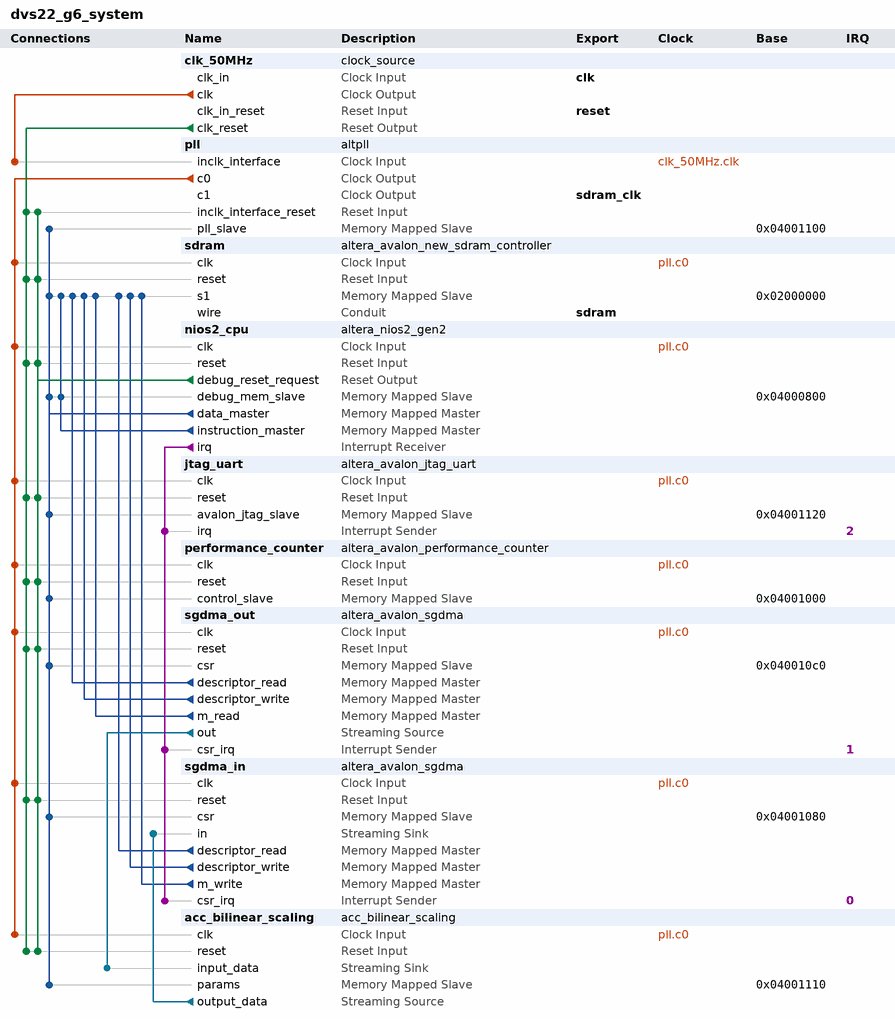
[diagram p0: system contents]
# Platform Designer (Qsys) system dvs22_g6_system, Cyclone IV E EP4CE22F17C6
# Parameters at their usual value, and those the tool derives, are not listed.
package require -exact qsys 20.1
create_system dvs22_g6_system
set_project_property DEVICE_FAMILY {Cyclone IV E}
set_project_property DEVICE EP4CE22F17C6

add_instance clk_50MHz clock_source 20.1
set_instance_parameter_value clk_50MHz clockFrequency 50000000

add_instance pll altpll 20.1
set_instance_parameter_value pll CLK0_DIVIDE_BY 1
set_instance_parameter_value pll CLK0_MULTIPLY_BY 1
set_instance_parameter_value pll CLK0_PHASE_SHIFT 3000
set_instance_parameter_value pll CLK1_DIVIDE_BY 1
set_instance_parameter_value pll CLK1_DUTY_CYCLE 50
set_instance_parameter_value pll CLK1_MULTIPLY_BY 1
set_instance_parameter_value pll CLK1_PHASE_SHIFT 0
set_instance_parameter_value pll INCLK0_INPUT_FREQUENCY 20000
set_instance_parameter_value pll PORT_ARESET PORT_UNUSED
set_instance_parameter_value pll PORT_LOCKED PORT_UNUSED
set_instance_parameter_value pll PORT_clk1 PORT_USED
set_instance_parameter_value pll PORT_clk2 PORT_UNUSED
set_instance_parameter_value pll PORT_clk3 PORT_UNUSED

add_instance sdram altera_avalon_new_sdram_controller 20.1
set_instance_parameter_value sdram TAC 5.5
set_instance_parameter_value sdram TRCD 20.0
set_instance_parameter_value sdram TRP 20.0
set_instance_parameter_value sdram casLatency 3
set_instance_parameter_value sdram columnWidth 9
set_instance_parameter_value sdram dataWidth 16
set_instance_parameter_value sdram generateSimulationModel false
set_instance_parameter_value sdram model single_Micron_MT48LC4M32B2_7_chip
set_instance_parameter_value sdram numberOfBanks 4
set_instance_parameter_value sdram numberOfChipSelects 1
set_instance_parameter_value sdram powerUpDelay 100.0
set_instance_parameter_value sdram refreshPeriod 15.625
set_instance_parameter_value sdram rowWidth 13

add_instance nios2_cpu altera_nios2_gen2 20.1
set_instance_parameter_value nios2_cpu dcache_size 2048
set_instance_parameter_value nios2_cpu exceptionSlave sdram.s1
set_instance_parameter_value nios2_cpu icache_size 4096
set_instance_parameter_value nios2_cpu impl Tiny
set_instance_parameter_value nios2_cpu resetSlave sdram.s1

add_instance jtag_uart altera_avalon_jtag_uart 20.1
set_instance_parameter_value jtag_uart simInteractiveOptions NO_INTERACTIVE_WINDOWS

add_instance performance_counter altera_avalon_performance_counter 20.1
set_instance_parameter_value performance_counter numberOfSections 4

add_instance sgdma_out altera_avalon_sgdma 20.1
set_instance_parameter_value sgdma_out enableBurstTransfers false
set_instance_parameter_value sgdma_out enableUnalignedTransfers false
set_instance_parameter_value sgdma_out readBlockDataWidth 8
set_instance_parameter_value sgdma_out sinkErrorWidth 0
set_instance_parameter_value sgdma_out sourceErrorWidth 0
set_instance_parameter_value sgdma_out transferMode MEMORY_TO_STREAM
set_instance_parameter_value sgdma_out writeBurstcountWidth 4

add_instance sgdma_in altera_avalon_sgdma 20.1
set_instance_parameter_value sgdma_in enableBurstTransfers false
set_instance_parameter_value sgdma_in enableUnalignedTransfers false
set_instance_parameter_value sgdma_in readBlockDataWidth 8
set_instance_parameter_value sgdma_in sinkErrorWidth 0
set_instance_parameter_value sgdma_in sourceErrorWidth 0
set_instance_parameter_value sgdma_in transferMode STREAM_TO_MEMORY
set_instance_parameter_value sgdma_in writeBurstcountWidth 4

add_instance acc_bilinear_scaling acc_bilinear_scaling 0.1

# connections
add_connection clk_50MHz.clk pll.inclk_interface clock
add_connection pll.c0 acc_bilinear_scaling.clk clock
add_connection pll.c0 jtag_uart.clk clock
add_connection pll.c0 nios2_cpu.clk clock
add_connection pll.c0 performance_counter.clk clock
add_connection pll.c0 sdram.clk clock
add_connection pll.c0 sgdma_in.clk clock
add_connection pll.c0 sgdma_out.clk clock
add_connection clk_50MHz.clk_reset acc_bilinear_scaling.reset reset
add_connection clk_50MHz.clk_reset jtag_uart.reset reset
add_connection clk_50MHz.clk_reset nios2_cpu.reset reset
add_connection clk_50MHz.clk_reset performance_counter.reset reset
add_connection clk_50MHz.clk_reset pll.inclk_interface_reset reset
add_connection clk_50MHz.clk_reset sdram.reset reset
add_connection clk_50MHz.clk_reset sgdma_in.reset reset
add_connection clk_50MHz.clk_reset sgdma_out.reset reset
add_connection nios2_cpu.debug_reset_request acc_bilinear_scaling.reset reset
add_connection nios2_cpu.debug_reset_request jtag_uart.reset reset
add_connection nios2_cpu.debug_reset_request nios2_cpu.reset reset
add_connection nios2_cpu.debug_reset_request performance_counter.reset reset
add_connection nios2_cpu.debug_reset_request pll.inclk_interface_reset reset
add_connection nios2_cpu.debug_reset_request sdram.reset reset
add_connection nios2_cpu.debug_reset_request sgdma_in.reset reset
add_connection nios2_cpu.debug_reset_request sgdma_out.reset reset
add_connection nios2_cpu.data_master acc_bilinear_scaling.params avalon
set_connection_parameter_value nios2_cpu.data_master/acc_bilinear_scaling.params baseAddress 0x04001110
add_connection nios2_cpu.data_master jtag_uart.avalon_jtag_slave avalon
set_connection_parameter_value nios2_cpu.data_master/jtag_uart.avalon_jtag_slave baseAddress 0x04001120
add_connection nios2_cpu.data_master nios2_cpu.debug_mem_slave avalon
set_connection_parameter_value nios2_cpu.data_master/nios2_cpu.debug_mem_slave baseAddress 0x04000800
add_connection nios2_cpu.data_master performance_counter.control_slave avalon
set_connection_parameter_value nios2_cpu.data_master/performance_counter.control_slave baseAddress 0x04001000
add_connection nios2_cpu.data_master pll.pll_slave avalon
set_connection_parameter_value nios2_cpu.data_master/pll.pll_slave baseAddress 0x04001100
add_connection nios2_cpu.data_master sdram.s1 avalon
set_connection_parameter_value nios2_cpu.data_master/sdram.s1 baseAddress 0x02000000
add_connection nios2_cpu.data_master sgdma_in.csr avalon
set_connection_parameter_value nios2_cpu.data_master/sgdma_in.csr baseAddress 0x04001080
add_connection nios2_cpu.data_master sgdma_out.csr avalon
set_connection_parameter_value nios2_cpu.data_master/sgdma_out.csr baseAddress 0x040010c0
add_connection nios2_cpu.instruction_master nios2_cpu.debug_mem_slave avalon
set_connection_parameter_value nios2_cpu.instruction_master/nios2_cpu.debug_mem_slave baseAddress 0x04000800
add_connection nios2_cpu.instruction_master sdram.s1 avalon
set_connection_parameter_value nios2_cpu.instruction_master/sdram.s1 baseAddress 0x02000000
add_connection sgdma_in.descriptor_read sdram.s1 avalon
set_connection_parameter_value sgdma_in.descriptor_read/sdram.s1 baseAddress 0x02000000
add_connection sgdma_in.descriptor_write sdram.s1 avalon
set_connection_parameter_value sgdma_in.descriptor_write/sdram.s1 baseAddress 0x02000000
add_connection sgdma_in.m_write sdram.s1 avalon
set_connection_parameter_value sgdma_in.m_write/sdram.s1 baseAddress 0x02000000
add_connection sgdma_out.descriptor_read sdram.s1 avalon
set_connection_parameter_value sgdma_out.descriptor_read/sdram.s1 baseAddress 0x02000000
add_connection sgdma_out.descriptor_write sdram.s1 avalon
set_connection_parameter_value sgdma_out.descriptor_write/sdram.s1 baseAddress 0x02000000
add_connection sgdma_out.m_read sdram.s1 avalon
set_connection_parameter_value sgdma_out.m_read/sdram.s1 baseAddress 0x02000000
add_connection acc_bilinear_scaling.output_data sgdma_in.in avalon_streaming
add_connection sgdma_out.out acc_bilinear_scaling.input_data avalon_streaming
add_connection nios2_cpu.irq jtag_uart.irq interrupt
set_connection_parameter_value nios2_cpu.irq/jtag_uart.irq irqNumber 2
add_connection nios2_cpu.irq sgdma_in.csr_irq interrupt
set_connection_parameter_value nios2_cpu.irq/sgdma_in.csr_irq irqNumber 0
add_connection nios2_cpu.irq sgdma_out.csr_irq interrupt
set_connection_parameter_value nios2_cpu.irq/sgdma_out.csr_irq irqNumber 1

# exported interfaces
add_interface clk clock sink
set_interface_property clk EXPORT_OF clk_50MHz.clk_in
add_interface reset reset sink
set_interface_property reset EXPORT_OF clk_50MHz.clk_in_reset
add_interface sdram conduit end
set_interface_property sdram EXPORT_OF sdram.wire
add_interface sdram_clk clock source
set_interface_property sdram_clk EXPORT_OF pll.c1

set_interconnect_requirement {$system} qsys_mm.clockCrossingAdapter HANDSHAKE
set_interconnect_requirement {$system} qsys_mm.enableEccProtection FALSE
set_interconnect_requirement {$system} qsys_mm.insertDefaultSlave FALSE
set_interconnect_requirement {$system} qsys_mm.maxAdditionalLatency 1

save_system dvs22_g6_system.qsys
